# EAGLE design EDL (EAGLE 7.2.0)
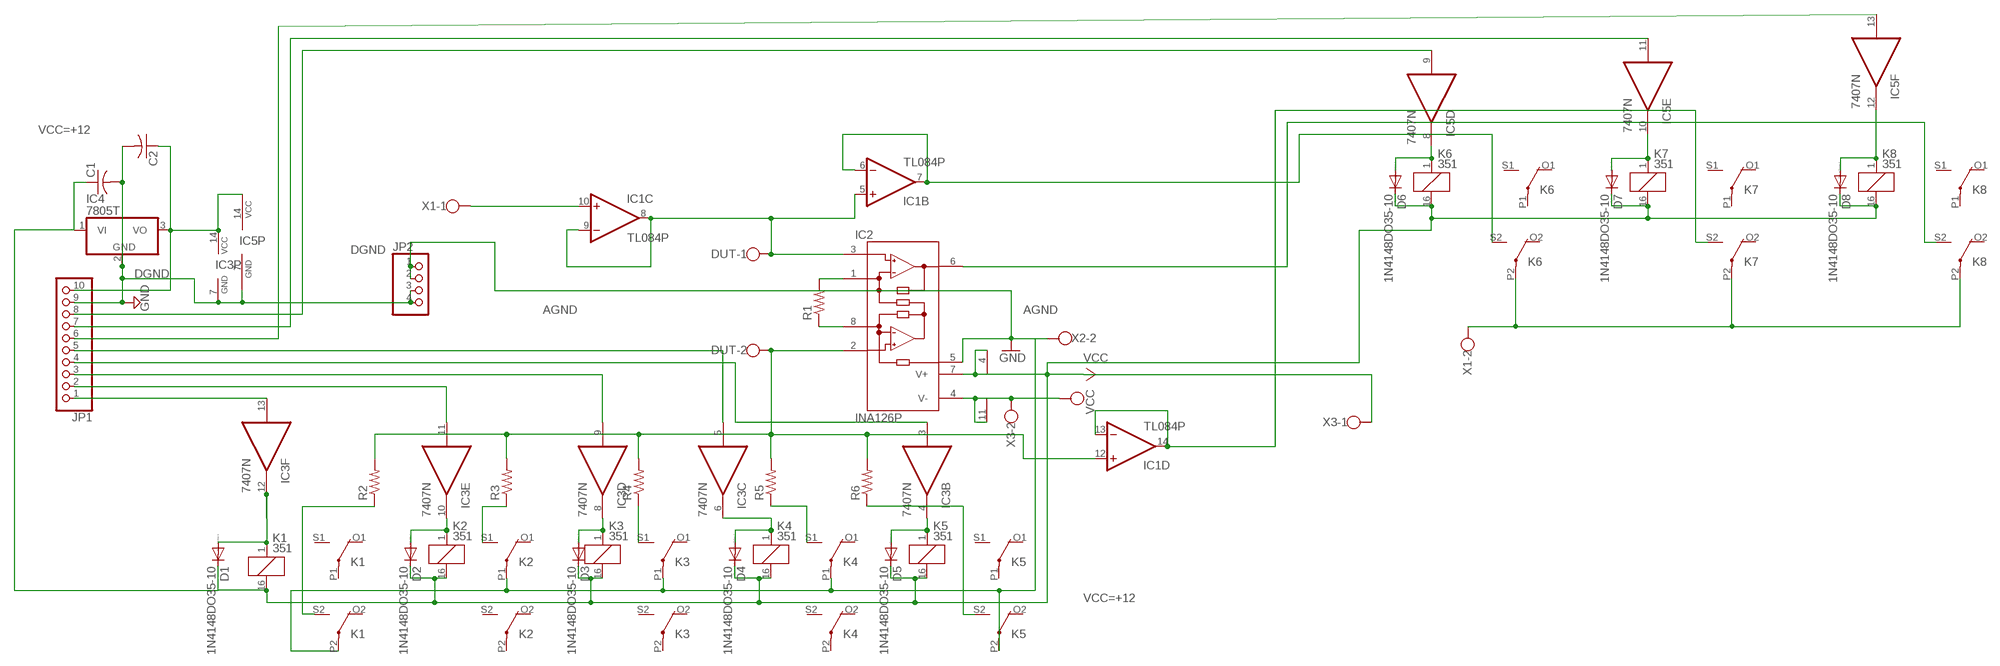
[diagram p0: schematic, sheet 1]

## Parts
C1  C-US050-024X044  [C050-024X044]
C2  C-US050-024X044  [C050-024X044]
D1  1N4148DO35-10  [DO35-10]
D2  1N4148DO35-10  [DO35-10]
D3  1N4148DO35-10  [DO35-10]
D4  1N4148DO35-10  [DO35-10]
D5  1N4148DO35-10  [DO35-10]
D6  1N4148DO35-10  [DO35-10]
D7  1N4148DO35-10  [DO35-10]
D8  1N4148DO35-10  [DO35-10]
DUT  W237-102  [W237-102]
IC1  TL084P  [DIL14]
IC2  INA126P  [DIL08]
IC3  7407N  [DIL14]
IC4  7805T  [TO220H]
IC5  7407N  [DIL14]
JP1  PINHD-1X10  [1X10]
JP2  PINHD-1X4  [1X04]
K1  351  [351]
K2  351  [351]
K3  351  [351]
K4  351  [351]
K5  351  [351]
K6  351  [351]
K7  351  [351]
K8  351  [351]
R1  R-US_0207/10  [0207/10]
R2  R-US_0207/10  [0207/10]
R3  R-US_0207/10  [0207/10]
R4  R-US_0207/10  [0207/10]
R5  R-US_0207/10  [0207/10]
R6  R-US_0207/10  [0207/10]
X1  W237-102  [W237-102]
X2  W237-102  [W237-102]
X3  W237-102  [W237-102]

## Nets
+5: C2.1 IC3.14(P:VCC) IC4.3(VO) IC5.14(P:VCC) JP1.10
AGND: IC2.5(REF) JP2.1 JP2.2 K1.P2(3:P) K2.P1(2:P) K3.P1(2:P) K4.P1(2:P) K5.P2(3:P) X2.2 ; supply symbol labelled GND
DGND: C1.2 C2.2 IC3.7(P:GND) IC4.2(GND) IC5.7(P:GND) JP1.9 JP2.3 JP2.4 ; supply symbol labelled GND
N$1: DUT.1 IC1.5(B:+IN) IC1.8(C:OUT) IC1.9(C:-IN) IC2.3(+IN)
N$2: IC1.10(C:+IN) X1.1
N$3: DUT.2 IC1.12(D:+IN) IC2.2(-IN) R2.2 R3.2 R4.2 R5.2 R6.2
N$4: IC2.1(RG) R1.2
N$5: IC2.8(RG) R1.1
N$6: D1.A IC3.12(F:O) K1.1
N$7: IC1.13(D:-IN) IC1.14(D:OUT) K7.S2(3:S)
N$8: D2.A IC3.10(E:O) K2.1
N$10: D3.A IC3.8(D:O) K3.1
N$12: D4.A IC3.6(C:O) K4.1
N$14: D5.A IC3.4(B:O) K5.1
N$16: K1.S2(3:S) R2.1
N$17: K2.S1(2:S) R3.1
N$18: K3.S1(2:S) R4.1
N$19: K4.S1(2:S) R5.1
N$20: K5.S2(3:S) R6.1
N$22: IC1.6(B:-IN) IC1.7(B:OUT) K6.S2(3:S)
N$24: IC5.11(E:I) JP1.7
N$27: IC5.13(F:I) JP1.6
N$28: IC5.9(D:I) JP1.8
N$30: IC2.6(OUT) K8.S2(3:S)
N$31: K6.P2(3:P) K7.P2(3:P) K8.P2(3:P) X1.2
N$32: IC3.13(F:I) JP1.1
N$33: IC3.11(E:I) JP1.2
N$34: IC3.9(D:I) JP1.3
N$35: IC3.5(C:I) JP1.5
N$36: IC3.3(B:I) JP1.4
N$38: D6.A IC5.8(D:O) K6.1
N$39: D7.A IC5.10(E:O) K7.1
N$40: D8.A IC5.12(F:O) K8.1
VCC(-12): IC1.11(P:V-) IC2.4(V-) X3.2 ; supply symbol labelled VCC
VCC=+12: C1.1 D1.C D2.C D3.C D4.C D5.C IC4.1(VI) K1.16 K2.16 K3.16 K4.16 K5.16
VSS: D6.C D7.C D8.C IC1.4(P:V+) IC2.7(V+) K6.16 K7.16 K8.16 X3.1 ; supply symbol labelled VCC
Unconnected: IC1.1(A:OUT) IC1.2(A:-IN) IC1.3(A:+IN) IC3.1(A:I) IC3.2(A:O) IC5.1(A:I) IC5.2(A:O) IC5.3(B:I) IC5.4(B:O) IC5.5(C:I) IC5.6(C:O) K1.O1(2:O) K1.O2(3:O) K1.P1(2:P) K1.S1(2:S) K2.O1(2:O) K2.O2(3:O) K2.P2(3:P) K2.S2(3:S) K3.O1(2:O) K3.O2(3:O) K3.P2(3:P) K3.S2(3:S) K4.O1(2:O) K4.O2(3:O) K4.P2(3:P) K4.S2(3:S) K5.O1(2:O) K5.O2(3:O) K5.P1(2:P) K5.S1(2:S) K6.O1(2:O) K6.O2(3:O) K6.P1(2:P) K6.S1(2:S) K7.O1(2:O) K7.O2(3:O) K7.P1(2:P) K7.S1(2:S) K8.O1(2:O) K8.O2(3:O) K8.P1(2:P) K8.S1(2:S) X2.1

## Library data of the parts
C1 C2 = resistor:C-US: CAPACITOR, American symbol
D1-D8 = diode:1N4148: DIODE high speed (Philips)
DUT X1-X3 = con-wago-500:W237-102: WAGO SCREW CLAMP; MPN: 237-102; OC_FARNELL: unknown; OC_NEWARK: 70K9898
IC1 = linear:TL084: OP AMP
IC2 = burr-brown:INA126: Instrumentation Amplifier Micropower, Single and Dual Versions; MF: TEXAS INSTRUMENT CONNECTORS; MPN: INA126P; OC_FARNELL: 1509595; OC_NEWARK: 74C9780
IC3 = 74xx-eu:74*07: Hex BUFFER, open collector high-voltage output
IC4 = linear:78*: Positive VOLTAGE REGULATOR Source: http://cache.national.com/ds/LM/LM78L05.pdf http://www.fairchildsemi.com/ds/LM/LM7805.pdf
IC5 = 74xx-us:74*07: Hex BUFFER, open collector high-voltage output
JP1 = pinhead:PINHD-1X10: PIN HEADER
JP2 = pinhead:PINHD-1X4: PIN HEADER
K1-K8 = relay:351: RELAY 2 x switch, Omron; OC_FARNELL: unknown; OC_NEWARK: unknown
R1-R6 = rcl:R-US_: RESISTOR, American symbol

## Board
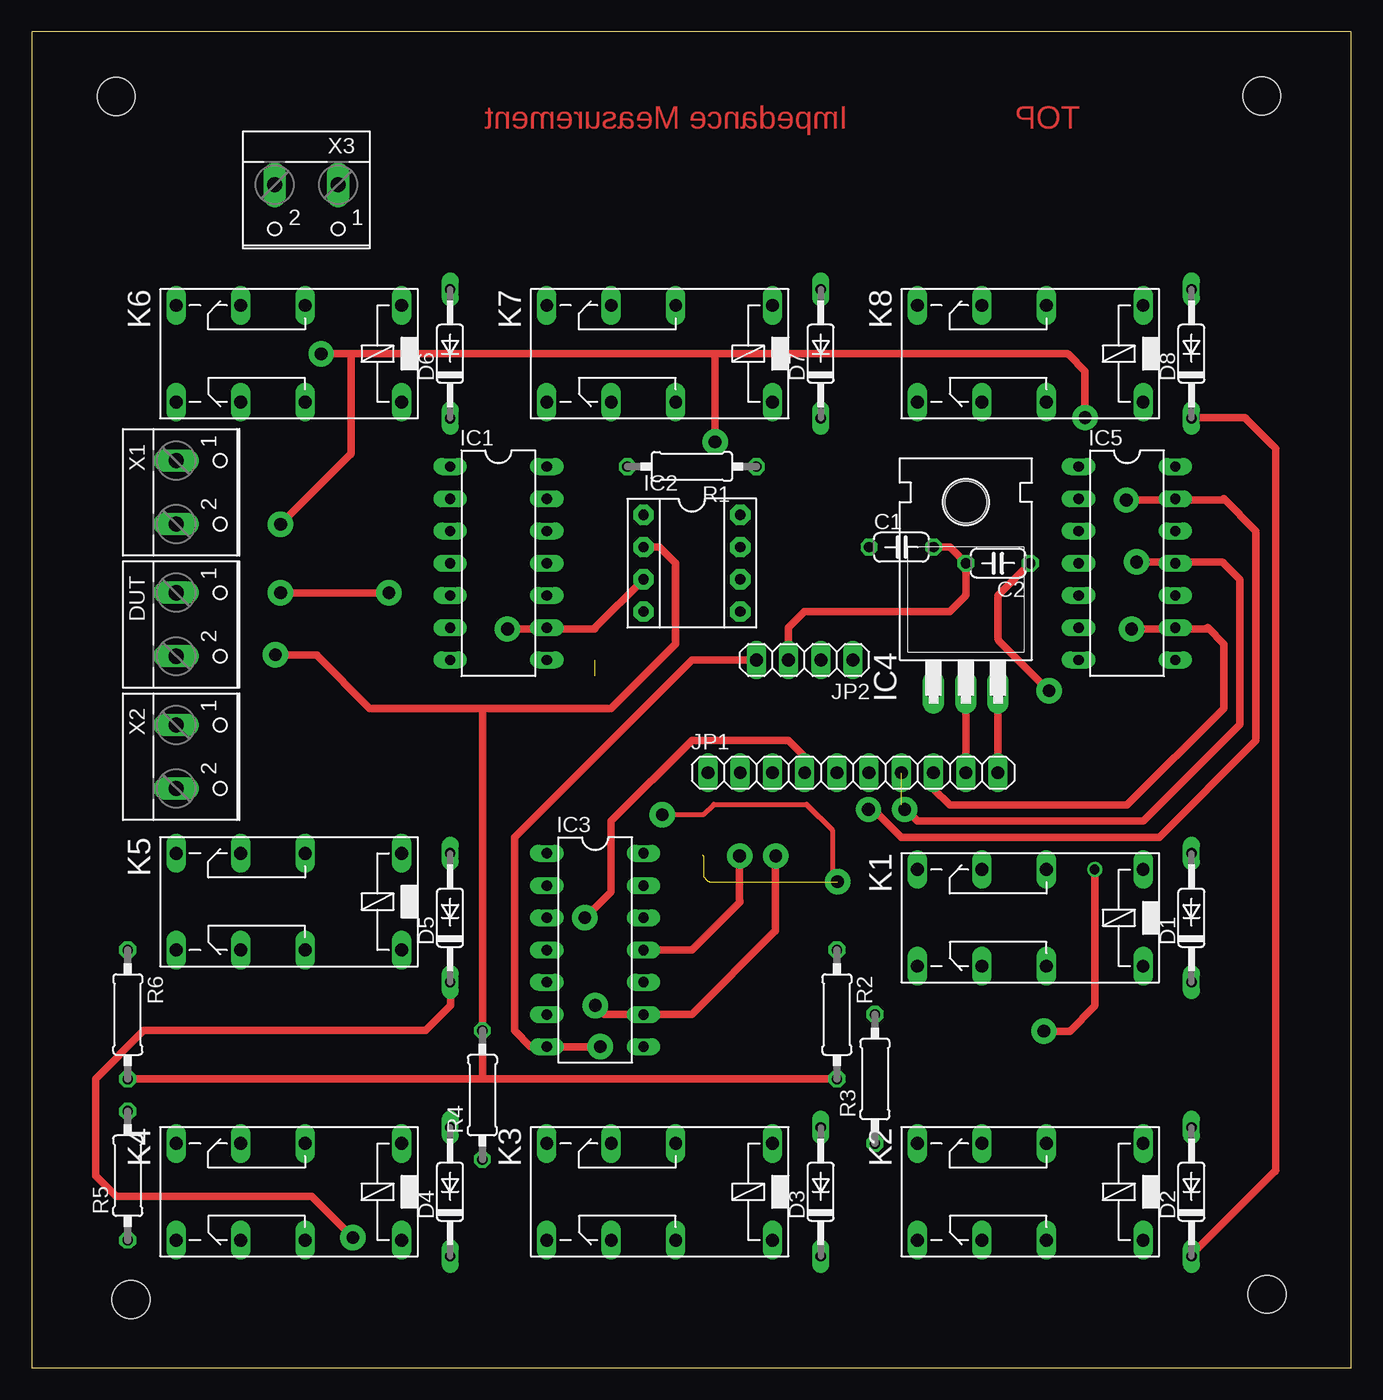
[diagram p1: board, top side]
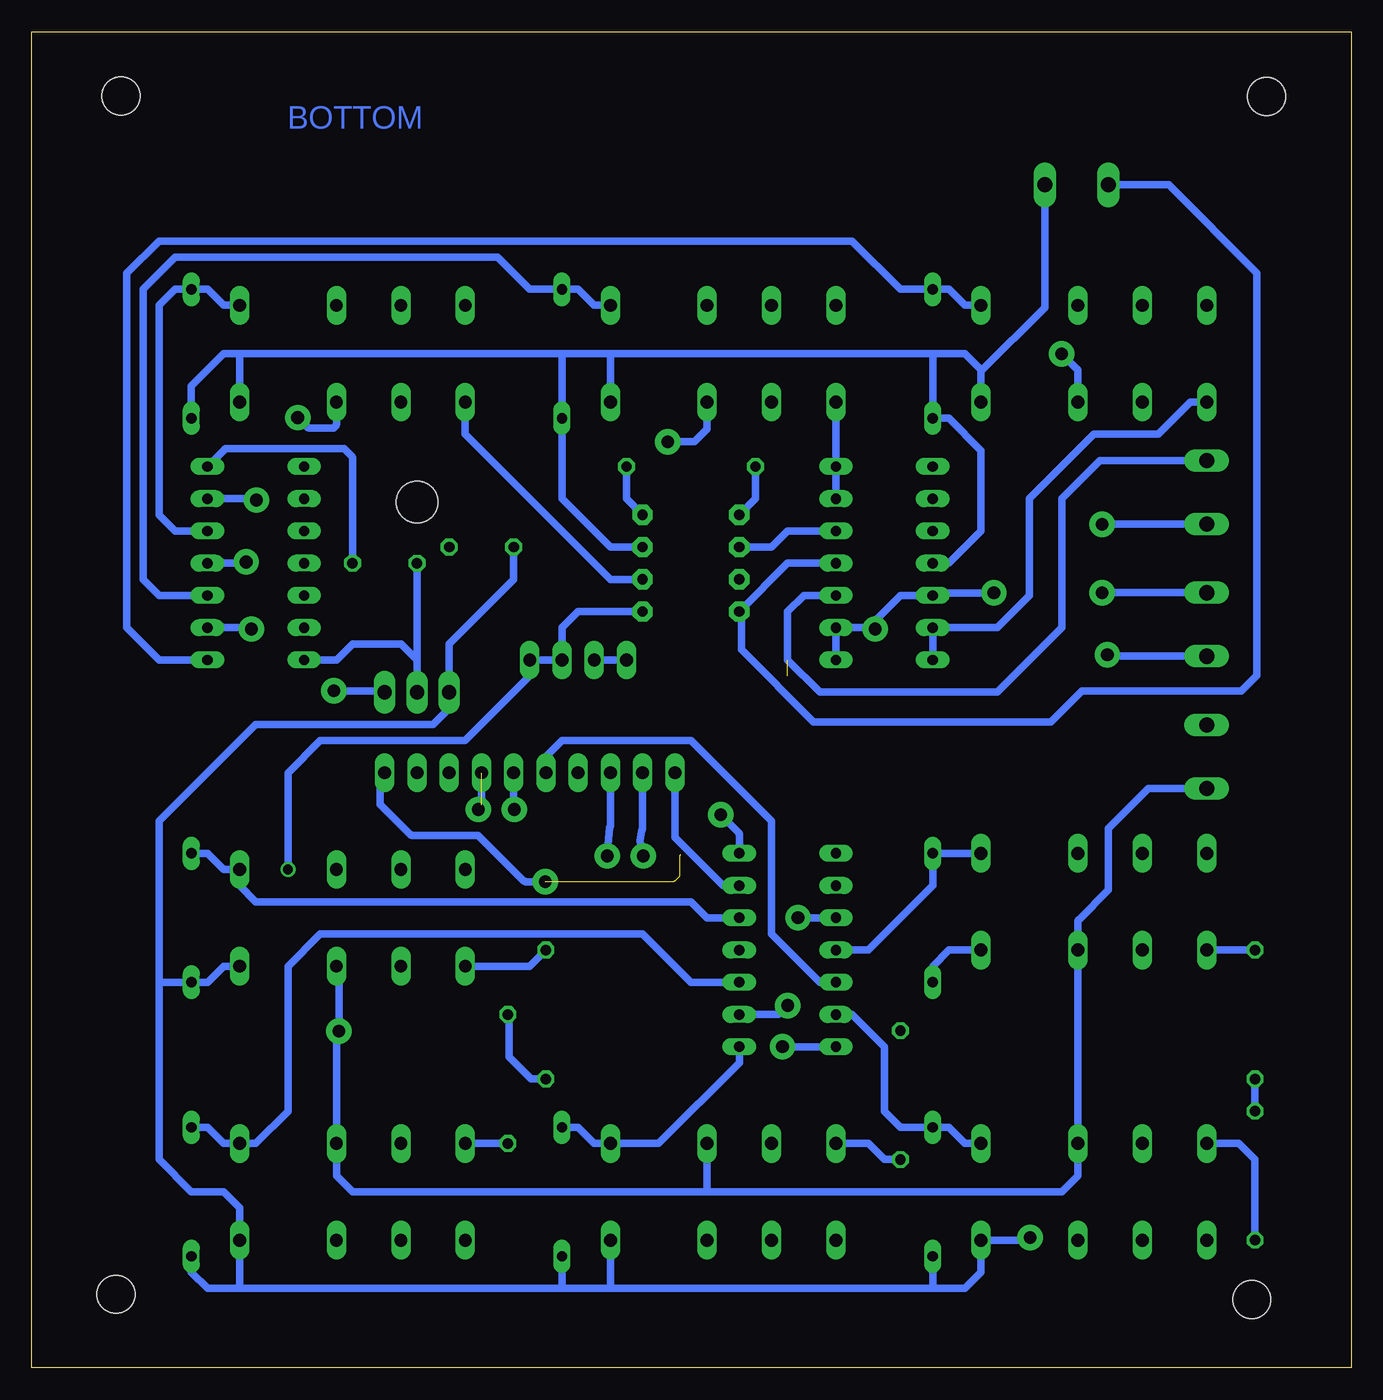
[diagram p2: board, bottom side, seen from below]

Size 103.97 x 105.28 mm. Coordinates in mm from the lower left corner, seen from the top.
Outline: 0,0 103.97,0 103.97,105.28 0,105.28 0,0
Copper layers (1*16): Top 0.035mm / dielectric 1.5mm / Bottom 0.035mm
Design rules "default *": minimum track width 10mil, minimum drill 24mil, track to track 16mil, track to pad 8mil, pad to pad 8mil, via to via 8mil, smd to smd 8mil, copper to edge 40mil, drill to drill 8mil, minimum pad ring 10mil, minimum via ring 8mil, stop-mask expansion 4mil, vias tented up to drill 0mil, thermal gap 10mil
Holes 3 mm at 97.33,5.79 96.93,100.23 6.65,100.18 7.82,5.38

### Footprints (pad centres in the part's own frame; a part is rotated, then mirrored left to right if it is on the bottom)
C050-024X044 = drill 0.813 octagon: 1 -2.54,0; 2 2.54,0
DO35-10 = drill 0.813 long: A 5.08,0; C -5.08,0
W237-102 = drill 1.194 long: 1 -2.5,-1.27; 2 2.5,-1.27
DIL14 = drill 0.813 long: 1 -7.62,-3.81; 2 -5.08,-3.81; 3 -2.54,-3.81; 4 0,-3.81; 5 2.54,-3.81; 6 5.08,-3.81; 7 7.62,-3.81; 8 7.62,3.81; 9 5.08,3.81; 10 2.54,3.81; 11 0,3.81; 12 -2.54,3.81; 13 -5.08,3.81; 14 -7.62,3.81
DIL08 = drill 0.813 pad 1.6 octagon: 1 -3.81,-3.81; 2 -1.27,-3.81; 3 1.27,-3.81; 4 3.81,-3.81; 5 3.81,3.81; 6 1.27,3.81; 7 -1.27,3.81; 8 -3.81,3.81
TO220H = drill 1.118 long: 1 -2.54,-10.16; 2 0,-10.16; 3 2.54,-10.16 | hole 3.302: 0,4.826
1X10 = drill 1.016 long: 1 -11.43,0; 2 -8.89,0; 3 -6.35,0; 4 -3.81,0; 5 -1.27,0; 6 1.27,0; 7 3.81,0; 8 6.35,0; 9 8.89,0; 10 11.43,0
1X04 = drill 1.016 long: 1 -3.81,0; 2 -1.27,0; 3 1.27,0; 4 3.81,0
351 = drill 1.016 long: 1 -3.81,-3.81; 16 -3.81,3.81; O1 8.89,-3.81; O2 8.89,3.81; P1 3.81,-3.81; P2 3.81,3.81; S1 13.97,-3.81; S2 13.97,3.81
0207/10 = drill 0.813 octagon: 1 -5.08,0; 2 5.08,0

### Placement (x,y rotation side)
C1  68.53,64.67 0 top
C2  76.15,63.4 180 top
D1  91.39,35.46 90 top
D2  91.39,13.87 90 top
D3  62.18,13.87 90 top
D4  32.97,13.87 90 top
D5  32.97,35.46 90 top
D6  32.97,79.91 90 top
D7  62.18,79.91 90 top
D8  91.39,79.91 90 top
DUT  12.65,58.57 270 top
IC1  36.78,63.4 270 top
IC2  52.02,63.4 270 top
IC3  44.4,32.92 270 top
IC4  73.61,63.4 0 top
IC5  86.31,63.4 270 top
JP1  64.72,46.89 0 top
JP2  60.91,55.78 180 top
K1  83.77,35.46 180 top
K2  83.77,13.87 180 top
K3  54.56,13.87 180 top
K4  25.35,13.87 180 top
K5  25.35,36.73 180 top
K6  25.35,79.91 180 top
K7  54.56,79.91 180 top
K8  83.77,79.91 180 top
R1  52.02,71.02 180 top
R2  63.45,27.84 270 top
R3  66.45,22.76 90 top
R4  35.51,21.49 90 top
R5  7.57,15.14 90 top
R6  7.57,27.84 270 top
X1  12.65,68.99 270 top
X2  12.65,48.16 270 top
X3  21.64,91.95 180 top

### Tracks (layer width: path | path; a pad name or v marks a point on that pad's centre or on a via)
+5  (via drill 1 pad 2)  (5 unrouted)
  Top 0.406: v49.68,43.59 52.93,43.59 53.75,44.4 61.06,44.4 63.09,42.37 63.09,38.71 v63.5,38.3
  Top 0.61: JP1.10 IC4.3 | C2.1 76.15,60.86 76.15,57.46 arc45 76.22,57.28 v80.16,53.34
  Bottom 0.61: C2.1 78.69,71.68 arc-45 78.76,71.85 79.35,72.44 88.59,72.44 arc-45 88.77,72.37 IC5.14 | v80.16,53.34 76.36,53.34 arc45 76.18,53.27 IC4.3 | IC3.14 48.21,42.01 arc-45 48.28,42.19 v49.68,43.59 | v63.5,38.3 65.02,38.3 arc45 65.2,38.38 68.78,41.96 73.96,41.96 arc45 74.14,42.04 76.51,44.4 76.51,46.43 arc45 76.43,46.61 JP1.10
AGND  (via drill 0.6, 0.7 pad 0.61, 0.76 pad 0.61, 1 pad 2)
  Top 0.61: v83.77,39.27 83.77,28.6 arc-45 83.7,28.42 81.79,26.52 v79.76,26.52
  Bottom 0.61: 50.75,13.87 22.81,13.87 21.54,15.14 K4.P1 K5.P2 21.54,35.12 arc45 21.47,35.3 19.13,37.64 19.13,42.49 16.04,45.58 arc45 15.86,45.66 X2.2 | 50.75,13.87 78.69,13.87 79.96,15.14 K2.P1 79.96,26.21 arc45 79.89,26.39 v79.76,26.52 79.76,31.34 arc-45 79.83,31.52 K1.P2 | K3.P1 50.75,13.87 | IC2.5 60.91,59.59 62.18,58.32 JP2.2 JP2.1 64.72,54.51 69.8,49.43 81.23,49.43 83.77,46.89 v83.77,39.27
DGND  (via drill 1 pad 2)
  Top 0.61: JP1.9 IC4.2 | JP2.4 52.02,55.78 38.05,41.81 38.05,26.57 39.32,25.3 v44.81,25.3 | JP2.3 59.64,58.32 60.91,59.59 72.34,59.59 73.54,60.78 arc45 73.61,60.96 C2.2 72.34,64.67 C1.2
  Bottom 0.61: IC5.7 79.96,55.78 78.69,57.05 74.88,57.05 73.61,55.78 IC4.2 C2.2 | JP2.4 JP2.3 | v44.81,25.3 IC3.7
N$1  (via drill 1 pad 2)
  Top 0.61: IC2.3 44.4,58.32 arc-90 44.3,58.22 v37.49,58.22 | v19.61,61.06 v28.14,61.06
  Bottom 0.61: IC1.8 IC1.9 37.59,58.32 arc90 v37.49,58.22 37.49,58.77 arc45 37.42,58.95 35.51,60.86 IC1.5 32.84,60.99 arc45 32.66,61.06 v28.14,61.06 | v19.61,61.06 arc90 19.6,61.07 DUT.1
N$2  (1 unrouted)
  Bottom 0.61: X1.1 19.8,71.49 22.81,68.48 22.81,58.32 27.89,53.24 41.86,53.24 44.4,55.78 44.4,59.59 43.13,60.86 IC1.10
N$3  (via drill 1 pad 2)
  Top 0.61: R6.2 35.51,22.76 | 35.51,22.76 R2.2 | 35.51,22.76 R4.2 35.51,51.97 | 35.51,51.97 26.62,51.97 22.52,56.07 arc90 22.4,56.18 v19.2,56.18 | 35.51,51.97 45.67,51.97 50.75,57.05 50.75,63.4 49.48,64.67 IC2.2
  Bottom 0.61: R5.2 R6.2 | IC1.12 44.4,65.94 45.67,64.67 IC2.2 | R2.2 64.62,22.76 66.35,24.49 66.35,27.74 R3.2 | v19.2,56.18 arc-90 19.09,56.07 DUT.2
N$4
  Bottom 0.61: R1.2 46.94,68.48 IC2.1
N$5
  Bottom 0.61: R1.1 57.1,68.48 IC2.8
N$6
  Bottom 0.61: D1.A 90.12,40.54 88.85,39.27 K1.1 87.58,38 86.31,36.73 52.02,36.73 50.75,35.46 IC3.12
N$7
  Bottom 0.61: IC1.13 IC1.14 K7.S2
N$8
  Bottom 0.61: D2.A 90.12,18.95 88.85,17.68 K2.1 86.31,17.68 83.77,20.22 83.77,31.65 81.23,34.19 55.83,34.19 52.02,30.38 IC3.10
N$9
  Top 0.61: 91.54,74.88 95.5,74.88 arc-45 95.68,74.8 98.04,72.44 98.04,15.65 arc-45 97.97,15.47 91.54,9.04
N$10
  Bottom 0.61: D3.A 60.91,18.95 59.64,17.68 K3.1 54.56,17.68 48.21,24.03 IC3.8
N$12
  Bottom 0.61: K4.1 30.43,17.68 31.7,18.95 D4.A 35.51,18.95 36.78,20.22 36.78,25.3 39.32,27.84 IC3.6
N$14
  Bottom 0.61: IC3.4 38.05,32.92 32.97,38 D5.A K5.1
N$16
  Bottom 0.61: R2.1 64.72,31.65 K1.S2
N$17
  Bottom 0.61: R3.1 K2.S1
N$18
  Bottom 0.61: R4.1 36.78,16.41 38.05,17.68 K3.S1
N$19
  Bottom 0.61: R5.1 7.57,16.41 8.84,17.68 K4.S1
N$20
  Bottom 0.61: R6.1 K5.S2
N$22
  Bottom 0.61: IC1.7 IC1.6 27.89,58.32 25.35,60.86 25.35,68.48 20.27,73.56 15.19,73.56 12.65,76.1 K6.S2
N$24  (via drill 1 pad 2)  (1 unrouted)
  Top 0.61: v87.07,63.5 93.72,63.5 arc-45 93.9,63.43 95.2,62.13 95.2,50.7 87.58,43.08 69.8,43.08 68.96,43.92 arc45 v68.78,43.99
  Bottom 0.61: v87.07,63.5 87.1,63.47 arc45 87.28,63.4 IC5.11 | v68.78,43.99 68.6,44.17 arc-45 68.53,44.35 JP1.7
N$27  (via drill 1 pad 2)
  Top 0.61: v86.26,68.38 93.72,68.38 arc45 93.9,68.45 93.93,68.48 96.47,65.94 96.47,49.43 88.85,41.81 68.53,41.81 66.42,43.92 arc45 66.24,43.99 v65.94,43.99
  Bottom 0.61: v86.26,68.38 86.29,68.4 arc-45 86.47,68.48 IC5.13 | v65.94,43.99 arc45 65.99,44.12 JP1.6
N$28  (via drill 1 pad 2)
  Top 0.61: v86.67,58.22 92.45,58.22 arc45 92.63,58.29 92.66,58.32 93.93,57.05 93.93,51.97 86.31,44.35 72.34,44.35 71.07,45.62 JP1.8
  Bottom 0.61: v86.67,58.22 86.69,58.24 arc-45 86.87,58.32 IC5.9
N$30
  Bottom 0.61: IC2.6 58.37,62.13 69.8,73.56 K8.S2
N$31  (via drill 1 pad 2)
  Top 0.61: v22.81,79.91 25.17,79.91 | 25.17,79.91 53.75,79.91 | 53.75,79.91 81.53,79.91 arc-45 81.71,79.83 83.01,78.54 v83.01,74.88 | v19.61,66.47 25.1,71.96 arc45 25.17,72.14 25.17,79.91 | v53.85,72.97 53.85,79.7 arc45 53.77,79.88 53.75,79.91
  Bottom 0.61: v19.61,66.47 11.41,66.47 arc-45 X1.2 | v22.81,79.91 21.61,78.71 arc45 21.54,78.53 K6.P2 | v53.85,72.97 51.85,72.97 arc-45 51.67,73.05 50.75,73.96 K7.P2 | v83.01,74.88 82.27,74.14 arc-45 82.09,74.07 80.16,74.07 80.03,74.2 arc-45 79.96,74.37 K8.P2
N$32
  Bottom 0.61: IC3.13 49.48,38 53.29,41.81 JP1.1
N$33  (via drill 1 pad 2)
  Top 0.61: IC3.11 52.02,32.92 55.83,36.73 arc-45 55.78,36.85 v55.78,40.34
  Bottom 0.61: v55.78,40.34 arc45 55.83,42.49 JP1.2
N$34  (via drill 1 pad 2)
  Top 0.61: v58.62,40.34 58.62,34.55 arc-45 58.55,34.37 52.02,27.84 45.22,27.84 arc-45 45.04,27.91 v44.4,28.55
  Bottom 0.61: v58.62,40.34 58.44,42.55 arc-45 58.37,42.73 JP1.3 | v44.4,28.55 45.04,27.91 arc45 45.22,27.84 IC3.9
N$35
  Bottom 0.61: IC3.5 41.86,30.38 45.67,34.19 45.67,43.08 52.02,49.43 62.18,49.43 63.45,48.16 JP1.5
N$36  (via drill 1 pad 2)
  Top 0.61: JP1.4 60.91,48.16 59.64,49.43 52.02,49.43 45.67,43.08 45.67,37.65 arc-45 45.6,37.47 v43.59,35.46
  Bottom 0.61: v43.59,35.46 IC3.3
N$38
  Bottom 0.61: K6.1 30.43,83.72 31.7,84.99 D6.A 35.51,84.99 39.32,88.8 93.93,88.8 96.47,86.26 96.47,58.32 93.93,55.78 IC5.8
N$39
  Bottom 0.61: K7.1 59.64,83.72 60.91,84.99 D7.A 64.72,84.99 67.26,87.53 92.66,87.53 95.2,84.99 95.2,62.13 93.93,60.86 IC5.10
N$40
  Bottom 0.61: K8.1 88.85,83.72 90.12,84.99 D8.A 92.66,84.99 93.93,83.72 93.93,67.21 92.66,65.94 IC5.12
VCC(-12)
  Bottom 0.61: IC1.11 44.4,63.4 IC2.4 48.06,59.44 48.06,56.59 42.37,50.9 23.67,50.9 21.23,53.34 8.64,53.34 7.42,54.56 7.42,86.26 14.38,93.22 X3.2
VCC=+12  (via drill 1 pad 2)
  Top 0.61: D5.C 33.02,30.33 33.02,28.55 31.04,26.57 8.84,26.57 5.03,22.76 5.03,15.14 6.58,13.59 arc45 6.76,13.51 22.05,13.51 v25.3,10.26
  Bottom 0.61: 32.97,6.25 30.43,6.25 29.16,7.52 K4.16 25.61,10.06 arc-45 25.43,10.13 v25.3,10.26 | 32.97,6.25 58.37,6.25 | 58.37,6.25 62.18,6.25 | 62.18,6.25 87.58,6.25 | 87.58,6.25 90.12,6.25 91.39,7.52 D2.C | 87.58,6.25 K2.16 87.58,12.6 88.85,13.87 91.39,13.87 93.93,16.41 93.93,30.38 | D3.C 62.18,6.25 | K3.16 58.37,6.25 | D4.C 32.97,6.25 | K1.16 88.85,31.65 90.12,30.38 D1.C 93.93,30.38 | 93.93,30.38 93.93,43.08 86.31,50.7 72.34,50.7 71.07,51.97 IC4.1 71.07,57.05 65.99,62.13 C1.1 | K5.16 31.7,32.92 32.97,31.65 D5.C
VSS
  Bottom 0.61: D8.C 91.39,77.37 88.85,79.91 87.58,79.91 | 87.58,79.91 62.18,79.91 | 62.18,79.91 58.37,79.91 | 58.37,79.91 32.97,79.91 | 32.97,79.91 30.43,79.91 29.16,78.64 29.16,78.54 | 29.16,78.54 K6.16 | 32.97,79.91 D6.C 31.7,74.83 29.16,72.29 29.16,65.94 31.7,63.4 IC1.4 | K7.16 58.37,79.91 | 62.18,79.91 D7.C 62.18,68.48 58.37,64.67 IC2.7 | K8.16 87.58,79.91 | X3.1 24.14,83.56 29.16,78.54

### Text on the board
Top: Impedance Measurement | TOP
Bottom: BOTTOM